# Altium schematic sheet Small_DDS.SchDoc
size A; SheetNumber: 12; SheetTotal: 16
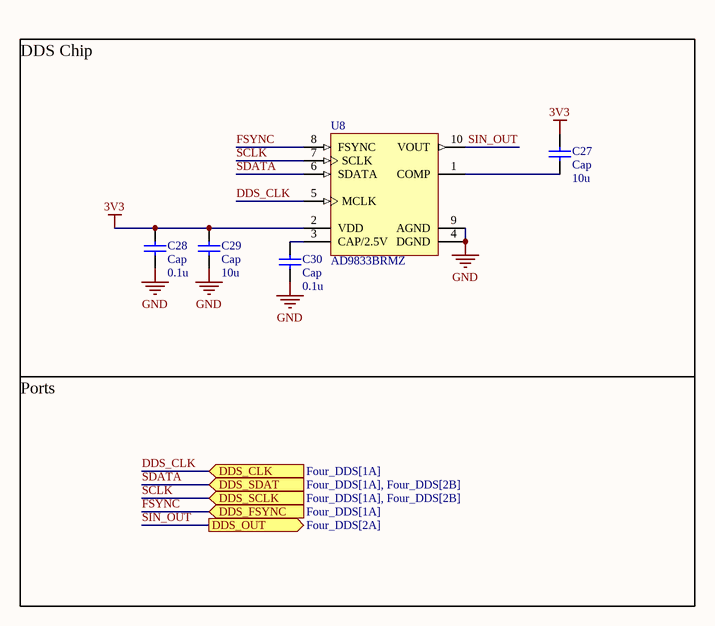
[diagram p0: Small_DDS.SchDoc]

## Parts
C27  Cap  value 10u  [0402_Res]
C28  Cap  value 0.1u  [0402_Res]
C29  Cap  value 10u  [0402_Res]
C30  Cap  value 0.1u  [0402_Res]
U8  AD9833BRMZ  [ADI-RM-10_M]

## Ports
DDS_CLK (in, see Four_DDS[1A]), DDS_FSYNC (in, see Four_DDS[1A]), DDS_OUT (out, see Four_DDS[2A]), DDS_SCLK (in, see Four_DDS[1A], Four_DDS[2B]), DDS_SDAT (in, see Four_DDS[1A], Four_DDS[2B])

## Nets
3V3: C27.2 C28.2 C29.2 U8.2(VDD)
GND: C28.1 C29.1 C30.1 U8.4(DGND) U8.9(AGND)
DDS_CLK: U8.5(MCLK) ; port DDS_CLK
FSYNC: U8.8(FSYNC) ; port DDS_FSYNC
SCLK: U8.7(SCLK) ; port DDS_SCLK
SDATA: U8.6(SDATA) ; port DDS_SDAT
SIN_OUT: U8.10(VOUT) ; port DDS_OUT
NetC27_1: C27.1 U8.1(COMP)
NetC30_2: C30.2 U8.3(CAP/2.5V)

## Notes on the sheet
- DDS Chip
- Ports

## Library data of the parts
C27-C30 = Cap: Capacitor; Published: 8-Jun-2000; LatestRevisionDate: 17-Jul-2002; LatestRevisionNote: Re-released for DXP Platform.; PackageReference: RAD-0.3; Publisher: Altium Limited; PackageDescription: Radial Cap, Thru-Hole; 2 Leads; 0.3 in Pin Spacing
U8 = CMP-0293-00077-1: Low Power, 12.65 mW, 2.3 V to 5.5 V, Programmable Waveform Generator, 10-Bit, Serial, RM-10, 50 Tube, Pb-Free; Resolution (Bits): 10bit; Compliance Range (V): 650mV; FS Iout (mA nom): 3mA; REFCLK Multiplier: No; Master fclk: 25MHz; I Supply total (max): 5.5mA; Tuning Word Width (bits): 28bit; Code_JEDEC: MO-187-BA; DatasheetVersion: Rev. D; PackageVersion: 5/8/2005; ComponentLink1URL: www.analog.com; ComponentLink3Description: Package Specification; PackageDescription: 10-Lead Mini Small Outline Package [MSOP]; I/O Interface: Serial; ComponentLink2Description: Datasheet; ComponentLink1Description: Manufacturer URL; PackageReference: RM-10; ComponentLink2URL: http://www.analog.com/static/imported-files/data_sheets/AD9833.pdf; ComponentLink3URL: http://www.analog.com/static/imported-files/packages/PKG_PDF/MSOP%28RM%29/RM_10.pdf